# EAGLE design Sch_PowerSupply (EAGLE 7.4.0)
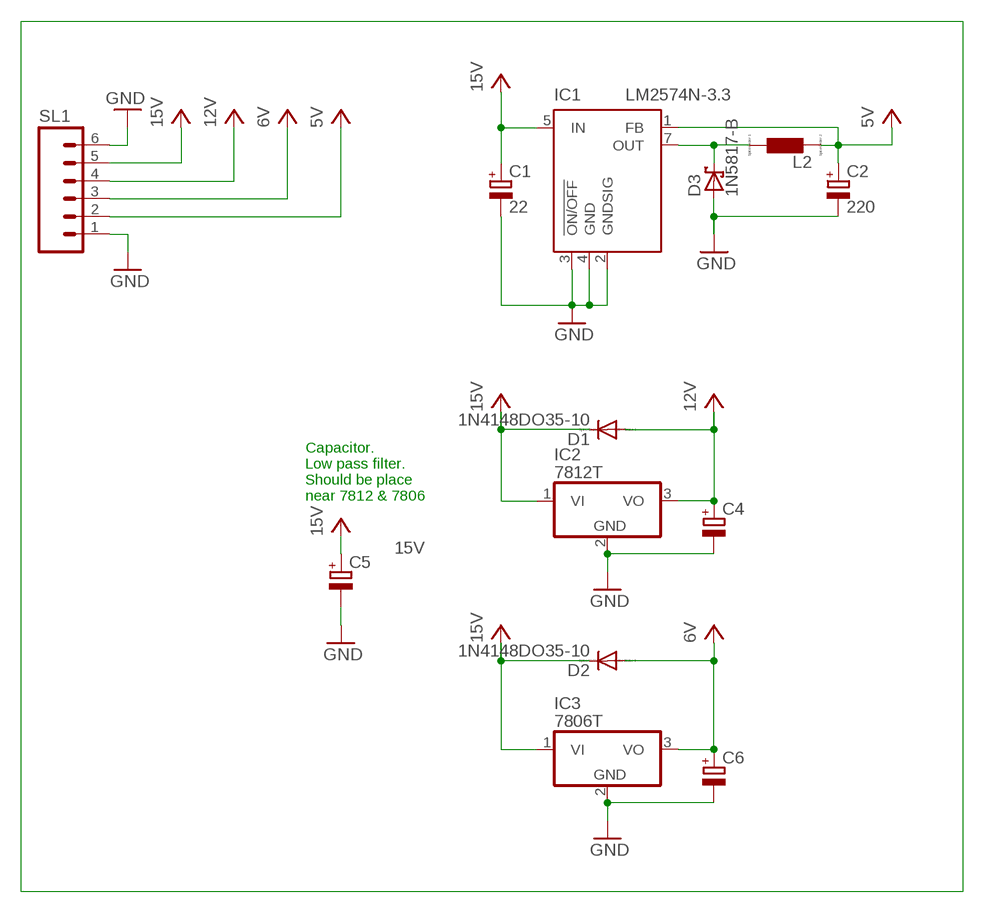
[diagram p0: schematic, sheet 1]

## Parts
C1  22  CPOL-EUE5-8.5  [E5-8,5]
C2  220  CPOL-EUE5-8.5  [E5-8,5]
C4  CPOL-EUE5-8.5  [E5-8,5]
C5  CPOL-EUE5-8.5  [E5-8,5]
C6  CPOL-EUE5-8.5  [E5-8,5]
D1  1N4148DO35-10  [DO35-10]
D2  1N4148DO35-10  [DO35-10]
D3  1N5817-B  [DO41-7.6]
IC1  LM2574N-3.3  [DIL08]
IC2  7812T  [TO220H]
IC3  7806T  [TO220H]
L2  L0204/7  [0204/7]
SL1  M06  [06P]

## Nets
5V: C2.+ IC1.1(FB) L2.2 SL1.2
6V: C6.+ D2.A IC3.3(VO) SL1.3
12V: C4.+ D1.A IC2.3(VO) SL1.4
15V: C1.+ C5.+ D1.C D2.C IC1.5(IN) IC2.1(VI) IC3.1(VI) SL1.5
GND: C1.- C2.- C4.- C5.- C6.- D3.A IC1.2(GNDSIG) IC1.3(!ON/OFF) IC1.4(GND) IC2.2(GND) IC3.2(GND) SL1.1 SL1.6
N$1: D3.C IC1.7(OUT) L2.1

## Notes on the sheet
- Capacitor.
  Low pass filter.
  Should be place 
  near 7812 & 7806

## Library data of the parts
C1 C2 C4-C6 = rcl:CPOL-EU: POLARIZED CAPACITOR, European symbol
D1 D2 = diode:1N4148: DIODE high speed (Philips)
D3 = diode:1N581*: 1.0A SCHOTTKY BARRIER RECTIFIER Source: http://www.diodes.com/datasheets/ds23001.pdf
IC1 = linear:LM2574?-*: SIMPLE SWITCHER 0.5A Step-Down Voltage Regulator Source: http://cache.national.com/ds/LM/LM2574.pdf
IC2 IC3 = linear:78*: Positive VOLTAGE REGULATOR Source: http://cache.national.com/ds/LM/LM78L05.pdf http://www.fairchildsemi.com/ds/LM/LM7805.pdf
L2 = eagle-ltspice:L: INDUCTOR, European symbol; SPICEMODEL: NONE; SPICEPREFIX: L
SL1 = con-amp-quick:M06: AMP QUICK CONNECTOR; OC_FARNELL: unknown; OC_NEWARK: unknown

## Board
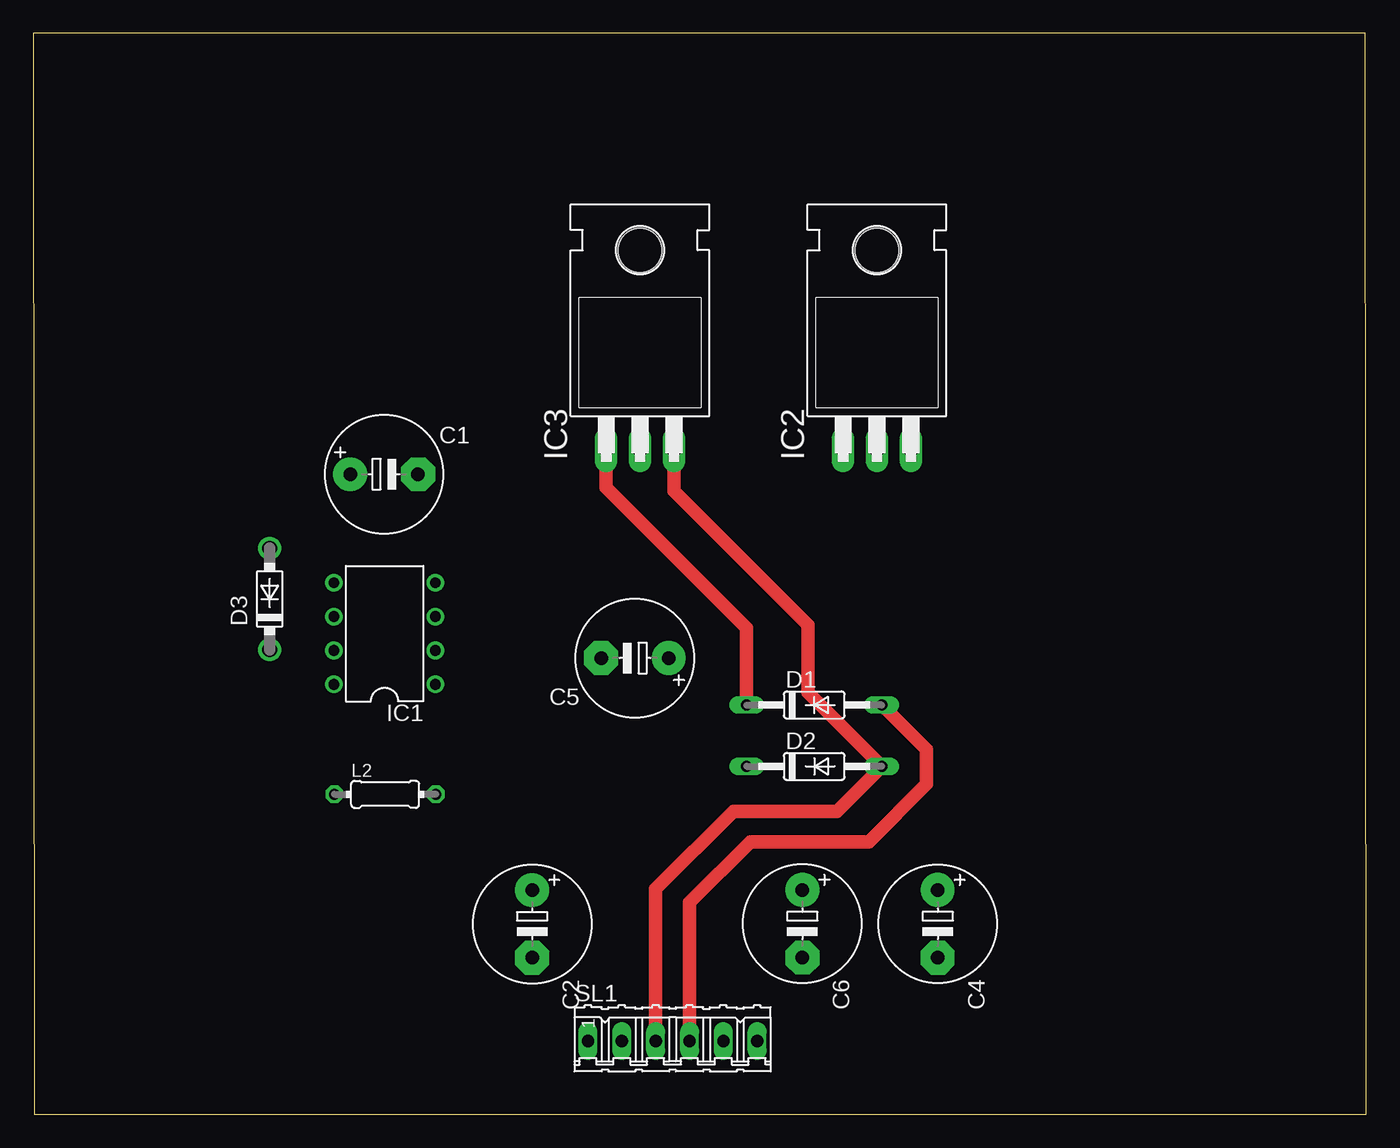
[diagram p1: board, top side]
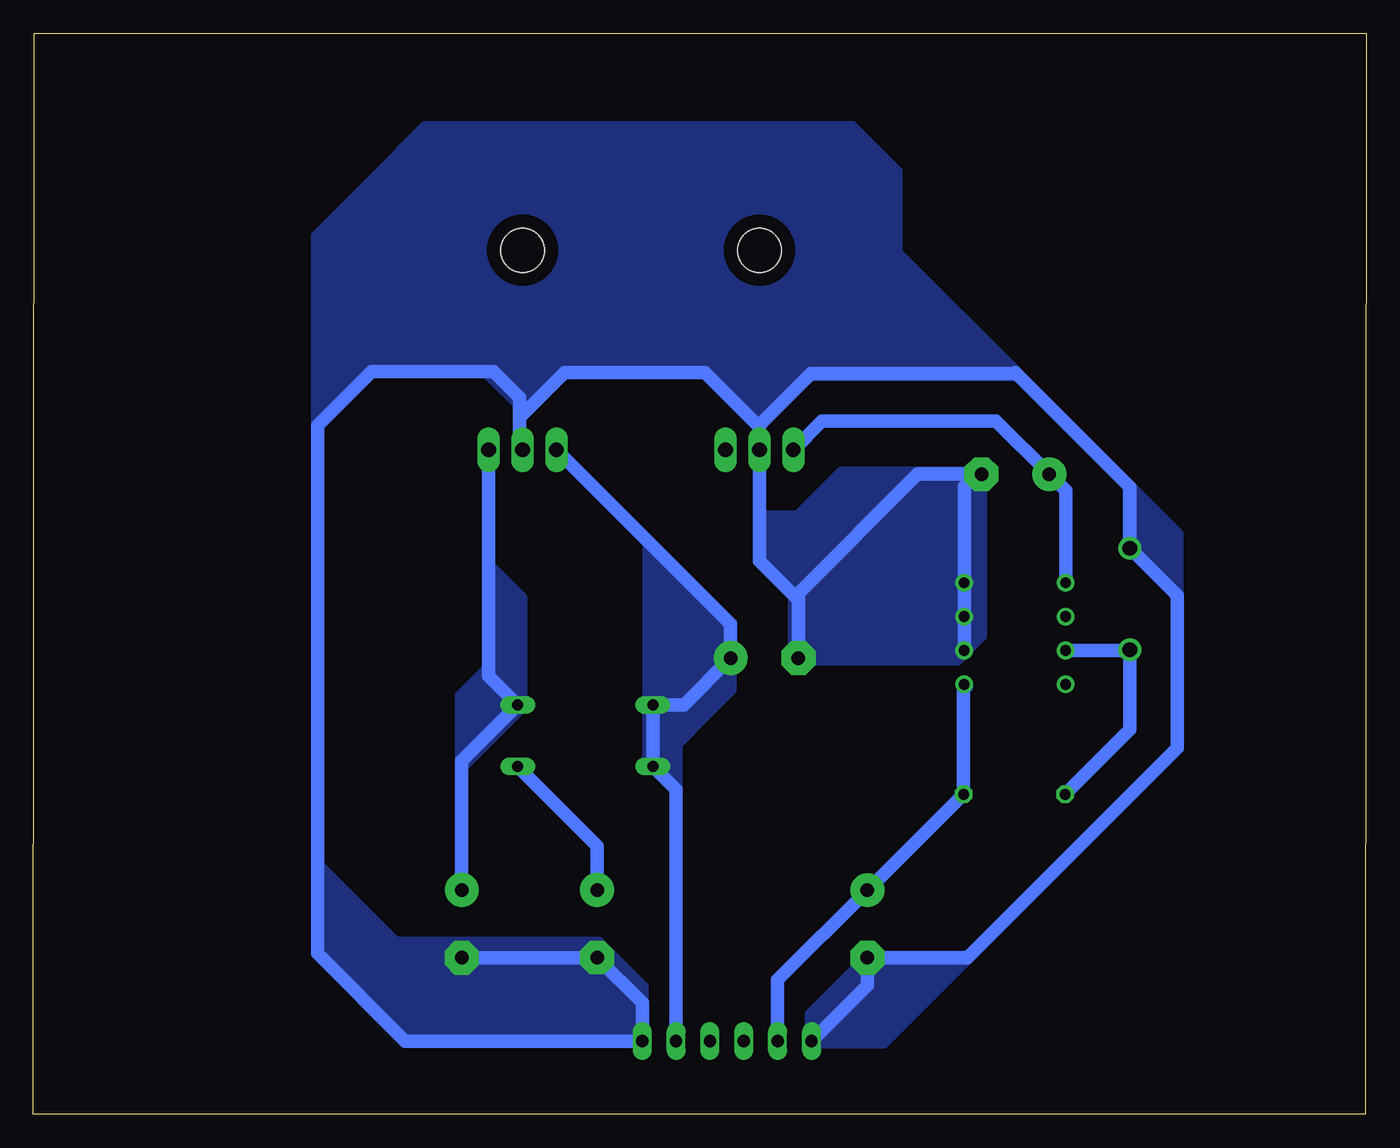
[diagram p2: board, bottom side, seen from below]

Size 100.08 x 81.17 mm. Coordinates in mm from the lower left corner, seen from the top.
Outline: 0.08,0 100.08,0 100,81.17 0,81.17 0.08,0
Copper layers (1*16): Top 0.035mm / dielectric 1.5mm / Bottom 0.035mm
Design rules "default": minimum track width 10mil, minimum drill 24mil, track to track 8mil, track to pad 8mil, pad to pad 8mil, via to via 8mil, smd to smd 8mil, copper to edge 40mil, drill to drill 8mil, minimum pad ring 10mil, minimum via ring 8mil, stop-mask expansion 4mil, vias tented up to drill 0mil, thermal gap 10mil

### Footprints (pad centres in the part's own frame; a part is rotated, then mirrored left to right if it is on the bottom)
E5-8,5 = drill 1.016 pad 2.54: + -2.54,0 | drill 1.016 pad 2.54 octagon: - 2.54,0
DO35-10 = drill 0.813 long: A 5.08,0; C -5.08,0
DO41-7.6 = drill 1.1 pad 1.7: A 3.81,0; C -3.81,0
DIL08 = drill 0.813 pad 1.27: 1 -3.81,-3.81; 2 -1.27,-3.81; 3 1.27,-3.81; 4 3.81,-3.81; 5 3.81,3.81; 6 1.27,3.81; 7 -1.27,3.81; 8 -3.81,3.81
TO220H = drill 1.118 long: 1 -2.54,-10.16; 2 0,-10.16; 3 2.54,-10.16 | hole 3.302: 0,4.826
0204/7 = drill 0.813 octagon: 1 -3.81,0; 2 3.81,0
06P = drill 0.914 long: 1 -6.35,0; 2 -3.81,0; 3 -1.27,0; 4 1.27,0; 5 3.81,0; 6 6.35,0

### Placement (x,y rotation side)
C1  26.34,48.06 0 top
C2  37.46,14.29 270 top
C4  67.91,14.3 270 top
C5  45.18,34.25 180 top
C6  57.75,14.3 270 top
D1  58.63,30.73 0 top
D2  58.63,26.12 0 top
D3  17.75,38.69 90 top
IC1  26.37,36.1 90 top
IC2  63.35,60.05 0 top
IC3  45.56,60.05 0 top
L2  26.42,24.03 0 top
SL1  48,5.5 0 top

### Tracks (layer width: path | path; a pad name or v marks a point on that pad's centre or on a via)
5V
  Bottom 1.016: SL1.2 44.19,10.1 C2.+ 30.26,24.03 | 30.03,32.13 IC1.1 30.26,32.21 30.26,24.03 | L2.2 30.26,24.03
6V
  Top 1.016: IC3.3 48.1,46.8 58.17,36.73 58.17,31.67 D2.A 60.35,22.76 52.58,22.76 46.73,16.91 SL1.3
  Bottom 1.016: C6.+ 57.75,20.16 D2.A
12V
  Top 1.016: D1.A 67.06,27.39 67.06,24.79 62.74,20.47 53.85,20.47 49.27,15.89 SL1.4
  Bottom 1.016: IC2.3 65.89,32.91 D1.A 67.91,26.54 C4.+
  pour Bottom (no thermals): 67.92,26.52 67.92,31.39 65.89,33.43 63.5,31.04 63.5,30.53 67.92,26.11
  pour Bottom (no thermals): 63.5,30.89 63.5,38.76 65.84,41.1 65.89,41.1 65.89,33.27
15V
  Top 1.016: IC3.1 43.02,47.05 53.55,36.52 D1.C
  Bottom 1.016: IC1.5 22.56,46.82 C1.+ 27.79,52.04 40.87,52.04 IC3.1 | IC2.1 47.72,36.8 C5.+ 51.23,30.73 D1.C D2.C 51.81,24.38 SL1.5
  pour Bottom (no thermals): 53.59,26.06 47.75,31.9 47.75,36.73 53.09,42.06 53.85,42.82 53.85,26.31
  pour Bottom (no thermals): 51.82,24.54 51.82,27.84 52.83,28.85 52.83,25.55
GND
  Bottom 1.016: IC1.2 IC1.3 IC1.4 30.18,47.13 29.41,47.9 | SL1.1 37.46,9.69 C2.- 29.96,11.75 14.2,27.51 14.2,38.95 D3.A 17.75,47.11 26.34,55.7 26.67,55.6 41.71,55.6 45.56,51.75 | 42.64,38.61 42.64,39.1 33.68,48.06 C1.- 28.96,47.98 28.96,47.9 29.41,47.9 | 42.64,38.61 C5.- | 45.56,51.75 IC3.2 45.56,41.53 42.64,38.61 | 45.56,51.75 45.7,51.75 49.63,55.68 60.17,55.68 63.55,52.3 | 63.55,52.3 63.55,50.1 IC2.2 | C6.- 54.35,8.36 SL1.6 72.15,5.5 78.74,12.09 78.74,51.71 74.68,55.78 65.53,55.78 63.55,53.8 63.55,52.3 | C6.- | C4.- C6.- | 29.39,47.93 29.41,47.9 | 29.41,47.9 29.46,47.9
  pour Bottom (no thermals): 26.16,55.52 42.42,55.52 45.47,52.48 49.02,56.03 59.94,56.03 62.99,52.98 63.25,52.98 66.04,55.78 74.42,55.78 74.42,70.26 70.61,74.07 38.61,74.07 35.31,70.76 35.31,64.67
  pour Bottom (no thermals): 54.36,5.49 54.36,9.55 57.66,12.85 78.49,12.85 78.49,12.6 71.63,5.74 54.61,5.74
  pour Bottom (no thermals): 78.74,12.09 78.74,18.69 72.64,12.6 72.64,8.03 76.71,12.09
  pour Bottom (no thermals): 41.68,5.46 36.25,5.46 29.92,11.79 37.36,11.79 40.79,8.36 41.66,7.49 41.66,5.49
  pour Bottom (no thermals): 14.22,39.01 17.78,42.57 17.78,47.14 14.22,43.59
  pour Bottom (no thermals): 29.97,34.95 28.96,35.97 28.96,47.9 33.53,47.9 42.93,38.51 42.93,34.44 42.67,34.19 30.73,34.19
  pour Bottom (no thermals): 33.27,48.16 39.37,48.16 42.67,44.86 45.47,44.86 45.47,42.06 42.42,39.01
  pour Bottom (no thermals): 33.27,48.16 28.96,48.16 28.96,47.9 30.99,45.87
  pour Bottom (no thermals): 78.74,51.71 78.74,65.94 74.17,70.51 74.17,56.29
N$1
  Bottom 1.016: IC1.7 17.8,34.83 D3.C 17.75,28.89 L2.1